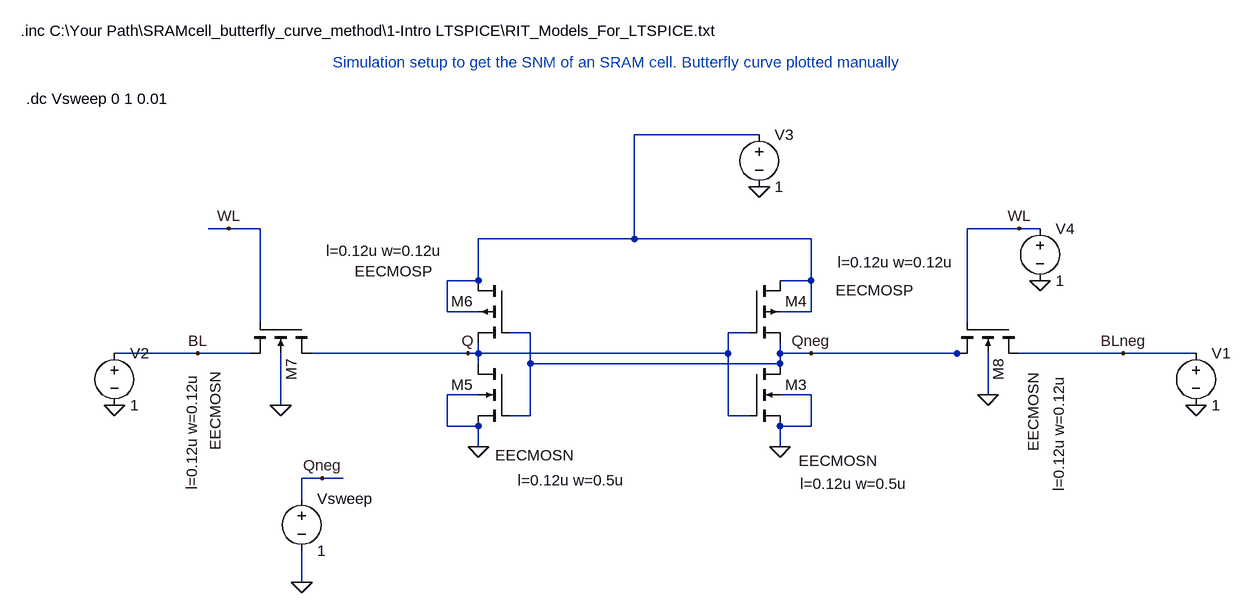
[diagram p0: schematic SNM.asc]
SNM.asc, the LTspice schematic file:
Version 4
SHEET 1 880 680
WIRE -416 -224 -608 -224
WIRE -1232 -80 -1264 -80
WIRE -1184 -80 -1232 -80
WIRE -16 -80 -96 -80
WIRE 16 -80 -16 -80
WIRE -608 -64 -608 -224
WIRE -608 -64 -848 -64
WIRE -336 -64 -608 -64
WIRE -848 0 -848 -64
WIRE -848 0 -896 0
WIRE -336 0 -336 -64
WIRE -336 0 -384 0
WIRE -896 48 -896 0
WIRE -848 48 -896 48
WIRE -336 48 -336 0
WIRE -336 48 -384 48
WIRE -1184 64 -1184 -80
WIRE -96 64 -96 -80
WIRE -768 80 -800 80
WIRE -432 80 -464 80
WIRE -1280 112 -1408 112
WIRE -1200 112 -1280 112
WIRE -864 112 -1104 112
WIRE -848 112 -848 96
WIRE -848 112 -864 112
WIRE -464 112 -464 80
WIRE -464 112 -848 112
WIRE -384 112 -384 96
WIRE -336 112 -384 112
WIRE -112 112 -336 112
WIRE -96 112 -112 112
WIRE 144 112 -16 112
WIRE 256 112 144 112
WIRE -848 128 -848 112
WIRE -768 128 -768 80
WIRE -384 128 -384 112
WIRE -384 128 -768 128
WIRE -848 176 -896 176
WIRE -336 176 -384 176
WIRE -64 176 -64 112
WIRE -1152 192 -1152 112
WIRE -768 208 -768 128
WIRE -768 208 -800 208
WIRE -464 208 -464 112
WIRE -432 208 -464 208
WIRE -896 224 -896 176
WIRE -848 224 -896 224
WIRE -336 224 -336 176
WIRE -336 224 -384 224
WIRE -848 256 -848 224
WIRE -384 256 -384 224
WIRE -1088 304 -1120 304
WIRE -1056 304 -1088 304
WIRE -1120 336 -1120 304
WIRE -1120 464 -1120 416
FLAG -384 256 0
FLAG -416 -144 0
FLAG -1120 464 0
FLAG -848 256 0
FLAG -64 176 0
FLAG -1152 192 0
FLAG -16 -80 WL
FLAG -1232 -80 WL
FLAG 256 192 0
FLAG -1408 192 0
FLAG -1280 112 BL
FLAG 144 112 BLneg
FLAG -864 112 Q
FLAG -336 112 Qneg
FLAG -1088 304 Qneg
FLAG 16 0 0
SYMBOL nmos4 -432 128 R0
WINDOW 123 79 185 Left 2
WINDOW 3 77 149 Left 2
SYMATTR Value2 l=0.12u w=0.5u
SYMATTR Value EECMOSN
SYMATTR InstName M3
SYMBOL pmos4 -432 0 R0
WINDOW 3 134 15 Left 2
WINDOW 123 137 -28 Left 2
SYMATTR Value EECMOSP
SYMATTR Value2 l=0.12u w=0.12u
SYMATTR InstName M4
SYMBOL voltage -416 -240 R0
WINDOW 123 0 0 Left 2
WINDOW 39 0 0 Left 2
SYMATTR InstName V3
SYMATTR Value 1
SYMBOL voltage -1120 320 R0
WINDOW 123 0 0 Left 2
WINDOW 39 0 0 Left 2
SYMATTR InstName Vsweep
SYMATTR Value 1
SYMBOL nmos4 -800 128 M0
WINDOW 123 -178 179 Left 2
WINDOW 3 -99 141 Left 2
SYMATTR Value2 l=0.12u w=0.5u
SYMATTR Value EECMOSN
SYMATTR InstName M5
SYMBOL pmos4 -800 0 M0
WINDOW 3 119 -14 Left 2
WINDOW 123 103 -46 Left 2
SYMATTR Value EECMOSP
SYMATTR Value2 l=0.12u w=0.12u
SYMATTR InstName M6
SYMBOL nmos4 -1104 64 R90
WINDOW 123 79 185 Left 2
WINDOW 3 77 149 Left 2
SYMATTR Value2 l=0.12u w=0.12u
SYMATTR Value EECMOSN
SYMATTR InstName M7
SYMBOL nmos4 -16 64 R90
WINDOW 123 81 -61 Left 2
WINDOW 3 79 -22 Left 2
SYMATTR Value2 l=0.12u w=0.12u
SYMATTR Value EECMOSN
SYMATTR InstName M8
SYMBOL voltage 256 96 R0
WINDOW 123 0 0 Left 2
WINDOW 39 0 0 Left 2
SYMATTR InstName V1
SYMATTR Value 1
SYMBOL voltage -1408 96 R0
WINDOW 123 0 0 Left 2
WINDOW 39 0 0 Left 2
SYMATTR InstName V2
SYMATTR Value 1
SYMBOL voltage 16 -96 R0
WINDOW 123 0 0 Left 2
WINDOW 39 0 0 Left 2
SYMATTR InstName V4
SYMATTR Value 1
TEXT -1072 -336 Left 2 ;Simulation setup to get the SNM of an SRAM cell. Butterfly curve plotted manually
TEXT -1544 -280 Left 2 !.dc Vsweep 0 1 0.01
TEXT -1552 -384 Left 2 !.inc C:\\Your Path\\SRAMcell_butterfly_curve_method\\1-Intro LTSPICE\\RIT_Models_For_LTSPICE.txt

The netlist it stands for:
* SNM.asc
M3 Qneg Q 0 0 EECMOSN l=0.12u w=0.5u
M4 N001 Q Qneg N001 EECMOSP l=0.12u w=0.12u
V3 N001 0 1
Vsweep Qneg 0 1
M5 Q Qneg 0 0 EECMOSN l=0.12u w=0.5u
M6 N001 Qneg Q N001 EECMOSP l=0.12u w=0.12u
M7 Q WL BL 0 EECMOSN l=0.12u w=0.12u
M8 BLneg WL Qneg 0 EECMOSN l=0.12u w=0.12u
V1 BLneg 0 1
V2 BL 0 1
V4 WL 0 1
.model NMOS NMOS
.model PMOS PMOS
.lib standard.mos
* Simulation setup to get the SNM of an SRAM cell. Butterfly curve plotted manually
.dc Vsweep 0 1 0.01
.inc C:\Your Path\SRAMcell_butterfly_curve_method\1-Intro LTSPICE\RIT_Models_For_LTSPICE.txt
.backanno
.end